# EAGLE schematic design1 (EAGLE 7.3.0)

## Sheet 1 of 3: MCU
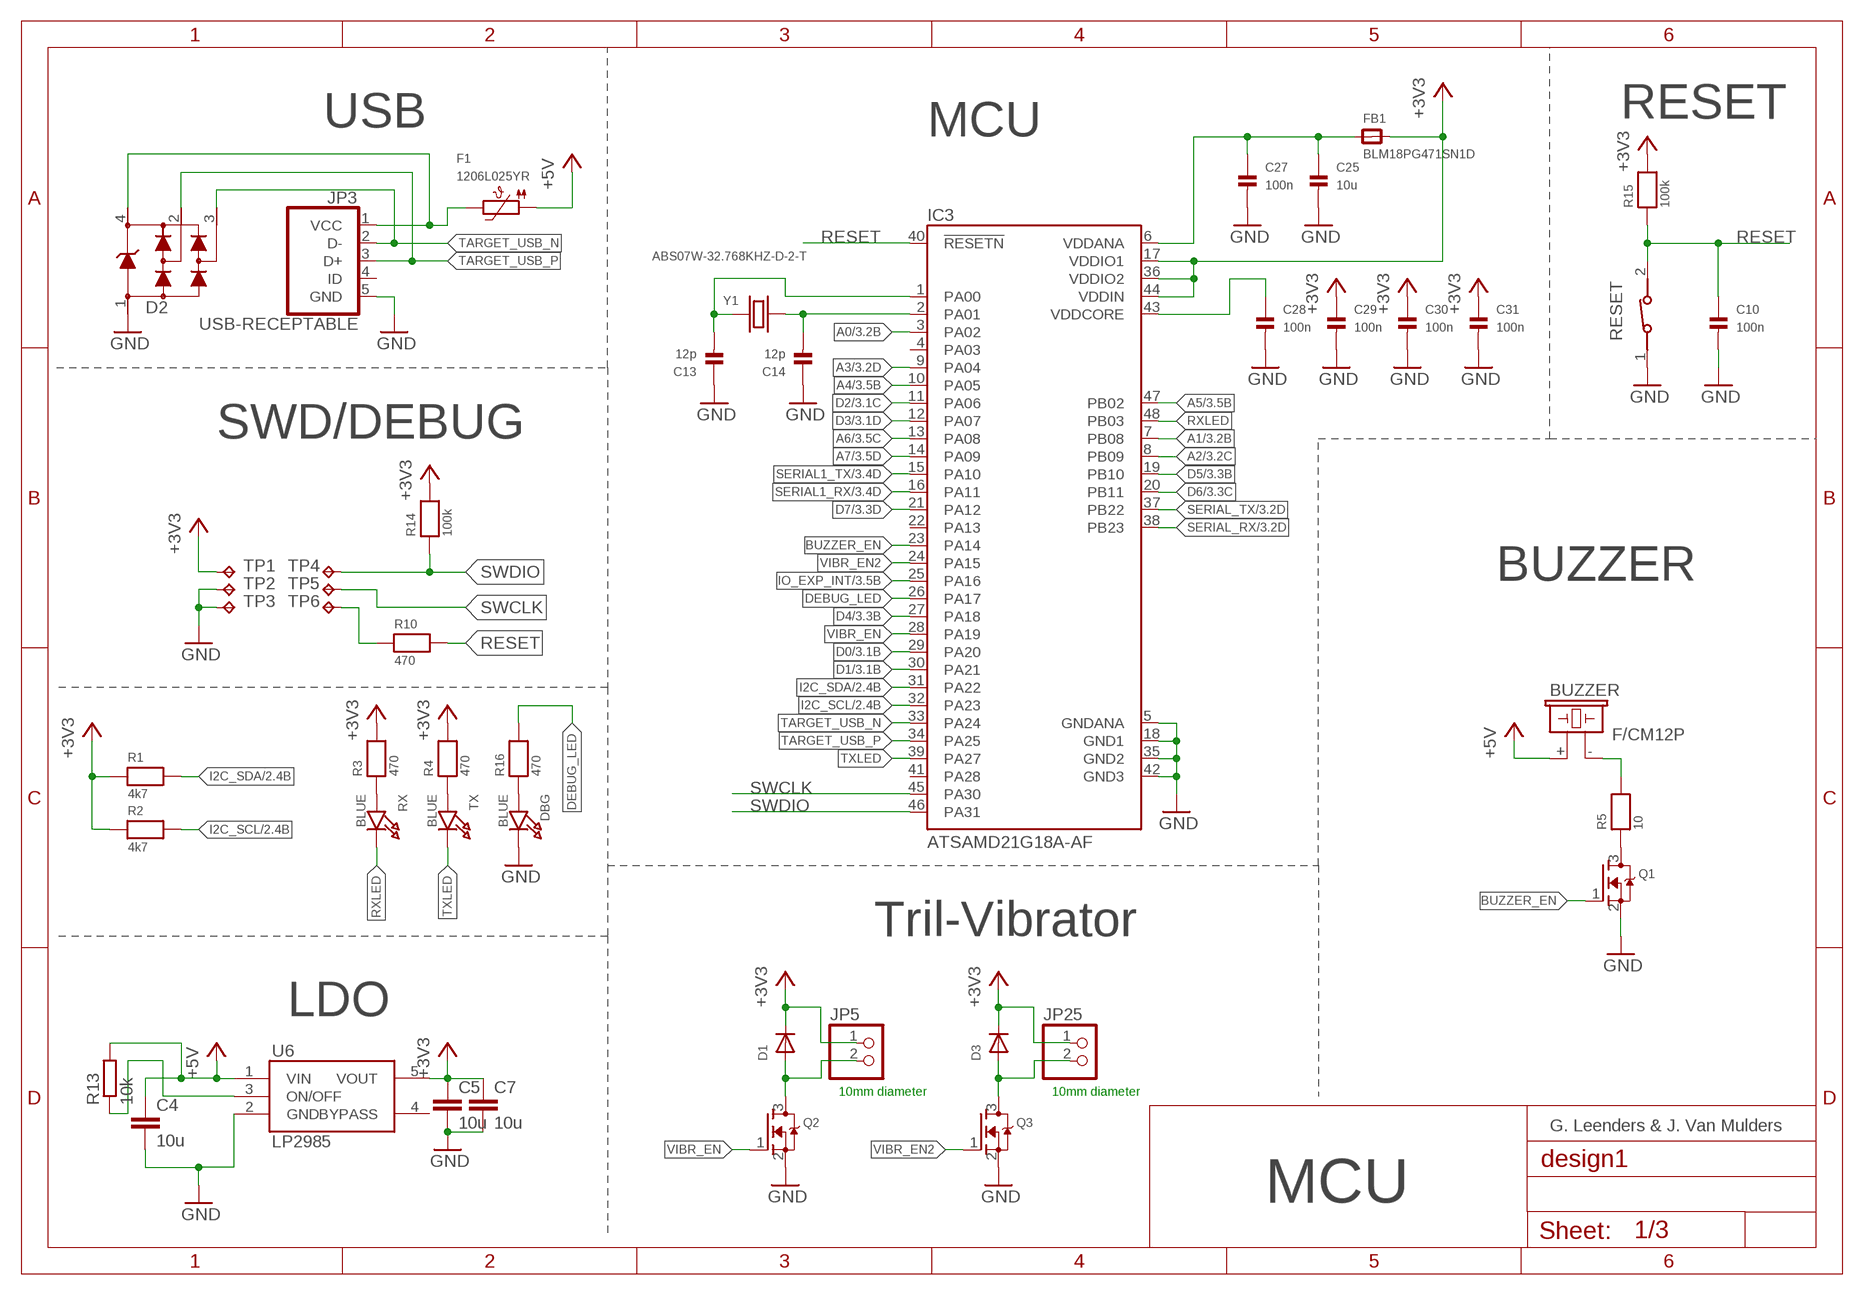
[diagram p0: schematic, sheet 1]

### Parts
BUZZER  F/CM12P  [F/CM12P]
C4  10u  C-EUC0805  [C0805]
C5  10u  C-EUC0805  [C0805]
C7  10u  C-EUC0805  [C0805]
C10  100n  CAP_CERAMIC0603  [0603]
C13  12p  CAP_CERAMIC0603  [0603]
C14  12p  CAP_CERAMIC0603  [0603]
C25  10u  CAP_CERAMIC0805  [0805]
C27  100n  CAP_CERAMIC0603  [0603]
C28  100n  CAP_CERAMIC0603  [0603]
C29  100n  CAP_CERAMIC0603  [0603]
C30  100n  CAP_CERAMIC0603  [0603]
C31  100n  CAP_CERAMIC0603  [0603]
D1  DIODESOD-123  [SOD-123]
D2  PRTR5V0U2X,215  [SOT143B]
D3  DIODESOD-123  [SOD-123]
DBG  BLUE  LED0805  [CHIPLED_0805]
F1  1206L025YR  PTC1206  [1206]
FB1  BLM18PG471SN1D  FERRITE_0603  [_0603]
IC3  ATSAMD21G18A-AF  [QFP50P900X900X120-48N]
JP3  USB-RECEPTABLE  [FCI-10103594-0001LF]
JP5  HEADER-1X2ROUND  [1X02_ROUND]
JP25  HEADER-1X2ROUND  [1X02_ROUND]
Q1  MOSFET-NWIDE  [SOT23-WIDE]
Q2  MOSFET-NWIDE  [SOT23-WIDE]
Q3  MOSFET-NWIDE  [SOT23-WIDE]
R1  4k7  RESISTOR0603  [0603]
R2  4k7  RESISTOR0603  [0603]
R3  470  RESISTOR0603  [0603]
R4  470  RESISTOR0603  [0603]
R5  10  RESISTOR0603  [0603]
R10  470  RESISTOR0603  [0603]
R13  10k  R-EU_R0603  [R0603]
R14  100k  RESISTOR0603  [0603]
R15  100k  RESISTOR0603  [0603]
R16  470  RESISTOR0603  [0603]
RESET  434111043826  [434111043826]
RX  BLUE  LED0805  [CHIPLED_0805]
TP1  TPTP11R  [TP11R]
TP2  TPTP11R  [TP11R]
TP3  TPTP11R  [TP11R]
TP4  TPTP11R  [TP11R]
TP5  TPTP11R  [TP11R]
TP6  TPTP11R  [TP11R]
TX  BLUE  LED0805  [CHIPLED_0805]
U6  LP2985AIM5-3.3  [SOT25]
Y1  ABS07W-32.768KHZ-D-2-T  [XTAL320X150X90]

### Nets
+3V3: C5.1 C7.1 C29.1 C30.1 C31.1 D1.C D3.C FB1.2 IC3.17(VDDIO1) IC3.36(VDDIO2) IC3.44(VDDIN) JP5.1 JP25.1 R1.1 R2.1 R3.2 R4.2 R14.2 R15.2 TP1.TP U6.5(VOUT) ; also sheet 2,3
+5V: BUZZER.+ C4.1 F1.1 R13.2 U6.1(VIN)
A0: IC3.3(PA02) ; also sheet 3
A1: IC3.7(PB08) ; also sheet 3
A2: IC3.8(PB09) ; also sheet 3
A3: IC3.9(PA04) ; also sheet 3
A4: IC3.10(PA05) ; also sheet 3
A5: IC3.47(PB02) ; also sheet 3
A6: IC3.13(PA08) ; also sheet 3
A7: IC3.14(PA09) ; also sheet 3
BUZZER_EN: IC3.23(PA14) Q1.1(G)
D0: IC3.29(PA20) ; also sheet 3
D1: IC3.30(PA21) ; also sheet 3
D2: IC3.11(PA06) ; also sheet 3
D3: IC3.12(PA07) ; also sheet 3
D4: IC3.27(PA18) ; also sheet 3
D5: IC3.19(PB10) ; also sheet 3
D6: IC3.20(PB11) ; also sheet 3
D7: IC3.21(PA12) ; also sheet 3
DEBUG_LED: IC3.26(PA17) R16.2
GND: C4.2 C5.2 C7.2 C10.2 C13.1 C14.1 C25.2 C27.2 C28.2 C29.2 C30.2 C31.2 D2.1 DBG.C IC3.5(GNDANA) IC3.18(GND1) IC3.35(GND2) IC3.42(GND3) JP3.5(GND) Q1.2(S) Q2.2(S) Q3.2(S) RESET.1 TP2.TP TP3.TP U6.2(GND) ; also sheet 2,3
I2C_SCL: IC3.32(PA23) R2.2 ; also sheet 2,3
I2C_SDA: IC3.31(PA22) R1.2 ; also sheet 2,3
IO_EXP_INT: IC3.25(PA16) ; also sheet 3
LDO_EN: R13.1 U6.3(ON/OFF)
N$1: R3.1 RX.A
N$2: R4.1 TX.A
N$3: BUZZER.- R5.2
N$4: C28.1 IC3.43(VDDCORE)
N$5: Q1.3(D) R5.1
N$6: C25.1 C27.1 FB1.1 IC3.6(VDDANA)
N$7: D2.4 F1.2 JP3.1(VCC)
N$8: D3.A JP25.2 Q3.3(D)
N$9: C13.2 IC3.1(PA00) Y1.1
N$10: C14.2 IC3.2(PA01) Y1.2
N$13: DBG.A R16.1
N$16: R10.1 TP6.TP
N$18: D1.A JP5.2 Q2.3(D)
RESET: C10.1 IC3.40(!RESETN) R10.2 R15.1 RESET.2
RXLED: IC3.48(PB03) RX.C
SERIAL1_RX: IC3.16(PA11) ; also sheet 3
SERIAL1_TX: IC3.15(PA10) ; also sheet 3
SERIAL_RX: IC3.38(PB23) ; also sheet 3
SERIAL_TX: IC3.37(PB22) ; also sheet 3
SWCLK: IC3.45(PA30) TP5.TP
SWDIO: IC3.46(PA31) R14.1 TP4.TP
TARGET_USB_N: D2.3 IC3.33(PA24) JP3.2(D-)
TARGET_USB_P: D2.2 IC3.34(PA25) JP3.3(D+)
TXLED: IC3.39(PA27) TX.C
VIBR_EN: IC3.28(PA19) Q2.1(G)
VIBR_EN2: IC3.24(PA15) Q3.1(G)
Unconnected: IC3.4(PA03) IC3.22(PA13) IC3.41(PA28) JP3.4(ID) U6.4(BYPASS)

### Notes on the sheet
- USB | RESET
- MCU
- SWD/DEBUG
- BUZZER
- Tril-Vibrator
- LDO
- 10mm diameter | 10mm diameter
- G. Leenders & J. Van Mulders
- MCU

## Sheet 2 of 3: 7-segment
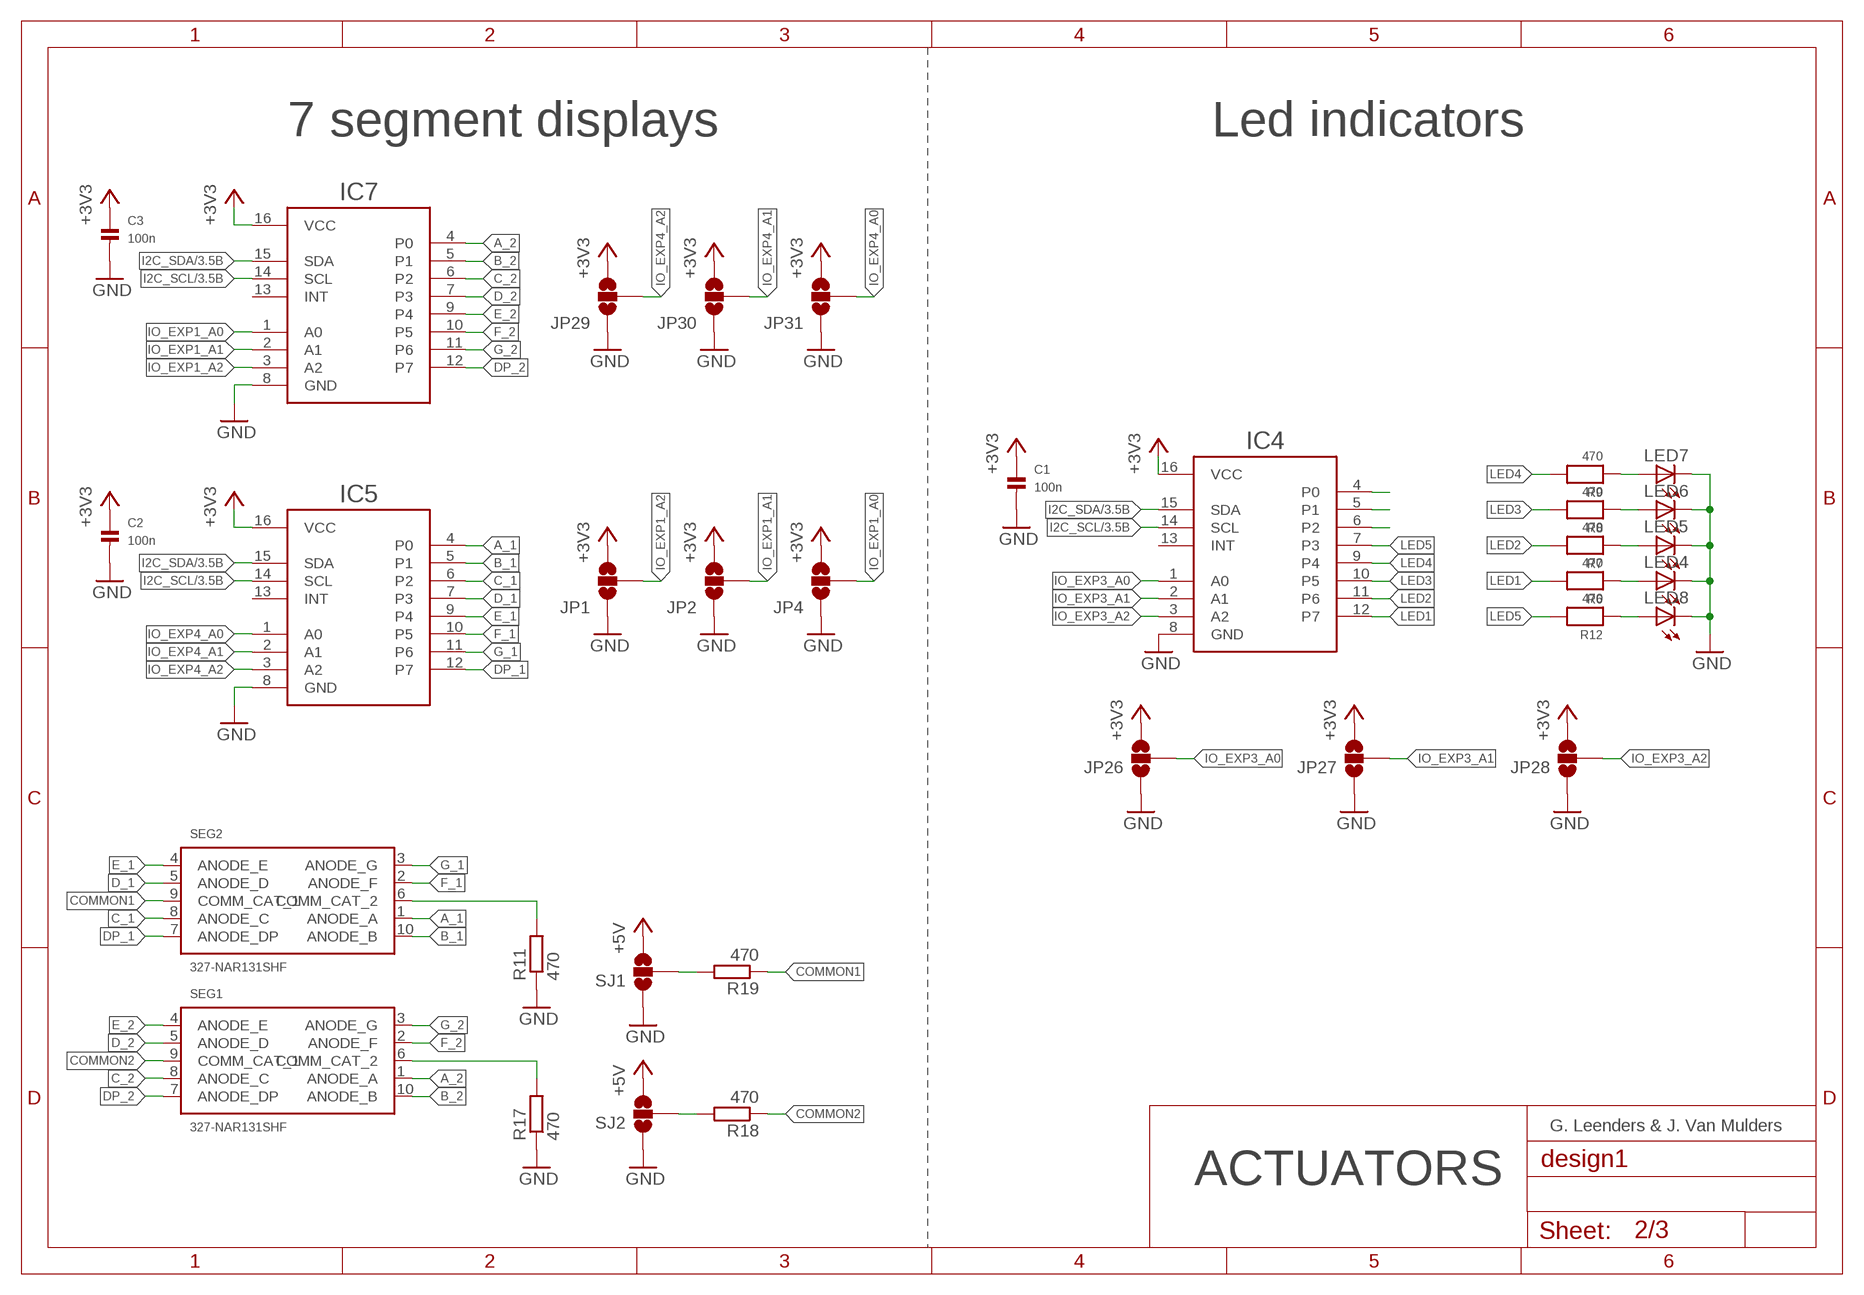
[diagram p1: schematic, sheet 2]

### Parts
C1  100n  CAP_CERAMIC0603  [0603]
C2  100n  CAP_CERAMIC0603  [0603]
C3  100n  CAP_CERAMIC0603  [0603]
IC4  TCA9554ADBR  [SSOP-16]
IC5  TCA9554ADBR  [SSOP-16]
IC7  TCA9554ADBR  [SSOP-16]
JP1  JUMPER-SMT_3_NO_NO-SILK  [SMT-JUMPER_3_NO_NO-SILK]
JP2  JUMPER-SMT_3_NO_NO-SILK  [SMT-JUMPER_3_NO_NO-SILK]
JP4  JUMPER-SMT_3_NO_NO-SILK  [SMT-JUMPER_3_NO_NO-SILK]
JP26  JUMPER-SMT_3_NO_NO-SILK  [SMT-JUMPER_3_NO_NO-SILK]
JP27  JUMPER-SMT_3_NO_NO-SILK  [SMT-JUMPER_3_NO_NO-SILK]
JP28  JUMPER-SMT_3_NO_NO-SILK  [SMT-JUMPER_3_NO_NO-SILK]
JP29  JUMPER-SMT_3_NO_NO-SILK  [SMT-JUMPER_3_NO_NO-SILK]
JP30  JUMPER-SMT_3_NO_NO-SILK  [SMT-JUMPER_3_NO_NO-SILK]
JP31  JUMPER-SMT_3_NO_NO-SILK  [SMT-JUMPER_3_NO_NO-SILK]
LED4  LED3MM  [LED3MM]
LED5  LED3MM  [LED3MM]
LED6  LED3MM  [LED3MM]
LED7  LED3MM  [LED3MM]
LED8  LED3MM  [LED3MM]
R6  470  RESISTOR0603  [0603]
R7  470  RESISTOR0603  [0603]
R8  470  RESISTOR0603  [0603]
R9  470  RESISTOR0603  [0603]
R11  470  R-EU_R0603  [R0603]
R12  470  RESISTOR0603  [0603]
R17  470  R-EU_R0603  [R0603]
R18  470  R-EU_R0603  [R0603]
R19  470  R-EU_R0603  [R0603]
SEG1  327-NAR131SHF  NAR131SH-F  [NAR131SH-F]
SEG2  327-NAR131SHF  NAR131SH-F  [NAR131SH-F]
SJ1  JUMPER-SMT_3_NO_NO-SILK  [SMT-JUMPER_3_NO_NO-SILK]
SJ2  JUMPER-SMT_3_NO_NO-SILK  [SMT-JUMPER_3_NO_NO-SILK]

### Nets
+3V3: C1.1 C2.1 C3.1 IC4.16(VCC) IC5.16(VCC) IC7.16(VCC) JP1.3 JP2.3 JP4.3 JP26.3 JP27.3 JP28.3 JP29.3 JP30.3 JP31.3 SJ1.3 SJ2.3 ; supply symbol labelled +5V ; also sheet 1,3
A_1: IC5.4(P0) SEG2.1(ANODE_A)
A_2: IC7.4(P0) SEG1.1(ANODE_A)
B_1: IC5.5(P1) SEG2.10(ANODE_B)
B_2: IC7.5(P1) SEG1.10(ANODE_B)
C_1: IC5.6(P2) SEG2.8(ANODE_C)
C_2: IC7.6(P2) SEG1.8(ANODE_C)
COMMON1: R19.1 SEG2.9(COMM_CAT_1)
COMMON2: R18.1 SEG1.9(COMM_CAT_1)
D_1: IC5.7(P3) SEG2.5(ANODE_D)
D_2: IC7.7(P3) SEG1.5(ANODE_D)
DP_1: IC5.12(P7) SEG2.7(ANODE_DP)
DP_2: IC7.12(P7) SEG1.7(ANODE_DP)
E_1: IC5.9(P4) SEG2.4(ANODE_E)
E_2: IC7.9(P4) SEG1.4(ANODE_E)
F_1: IC5.10(P5) SEG2.2(ANODE_F)
F_2: IC7.10(P5) SEG1.2(ANODE_F)
G_1: IC5.11(P6) SEG2.3(ANODE_G)
G_2: IC7.11(P6) SEG1.3(ANODE_G)
GND: C1.2 C2.2 C3.2 IC4.8(GND) IC5.8(GND) IC7.8(GND) JP1.1 JP2.1 JP4.1 JP26.1 JP27.1 JP28.1 JP29.1 JP30.1 JP31.1 LED4.K(C) LED5.K(C) LED6.K(C) LED7.K(C) LED8.K(C) R11.1 R17.1 SJ1.1 SJ2.1 ; also sheet 1,3
I2C_SCL: IC4.14(SCL) IC5.14(SCL) IC7.14(SCL) ; also sheet 1,3
I2C_SDA: IC4.15(SDA) IC5.15(SDA) IC7.15(SDA) ; also sheet 1,3
IO_EXP1_A0: IC7.1(A0) JP4.2
IO_EXP1_A1: IC7.2(A1) JP2.2
IO_EXP1_A2: IC7.3(A2) JP1.2
IO_EXP3_A0: IC4.1(A0) JP26.2
IO_EXP3_A1: IC4.2(A1) JP27.2
IO_EXP3_A2: IC4.3(A2) JP28.2
IO_EXP4_A0: IC5.1(A0) JP31.2
IO_EXP4_A1: IC5.2(A1) JP30.2
IO_EXP4_A2: IC5.3(A2) JP29.2
LED1: IC4.12(P7) R6.2
LED2: IC4.11(P6) R7.2
LED3: IC4.10(P5) R8.2
LED4: IC4.9(P4) R9.2
LED5: IC4.7(P3) R12.2
N$11: IC4.4(P0)
N$12: IC4.5(P1)
N$14: IC4.6(P2)
N$17: R17.2 SEG1.6(COMM_CAT_2)
N$19: LED8.A R12.1
N$20: LED4.A R6.1
N$21: LED5.A R7.1
N$22: LED6.A R8.1
N$23: LED7.A R9.1
N$24: R11.2 SEG2.6(COMM_CAT_2)
N$25: R19.2 SJ1.2
N$26: R18.2 SJ2.2
Unconnected: IC4.13(INT) IC5.13(INT) IC7.13(INT)

### Notes on the sheet
- 7 segment displays | Led indicators
- G. Leenders & J. Van Mulders
- ACTUATORS

## Sheet 3 of 3
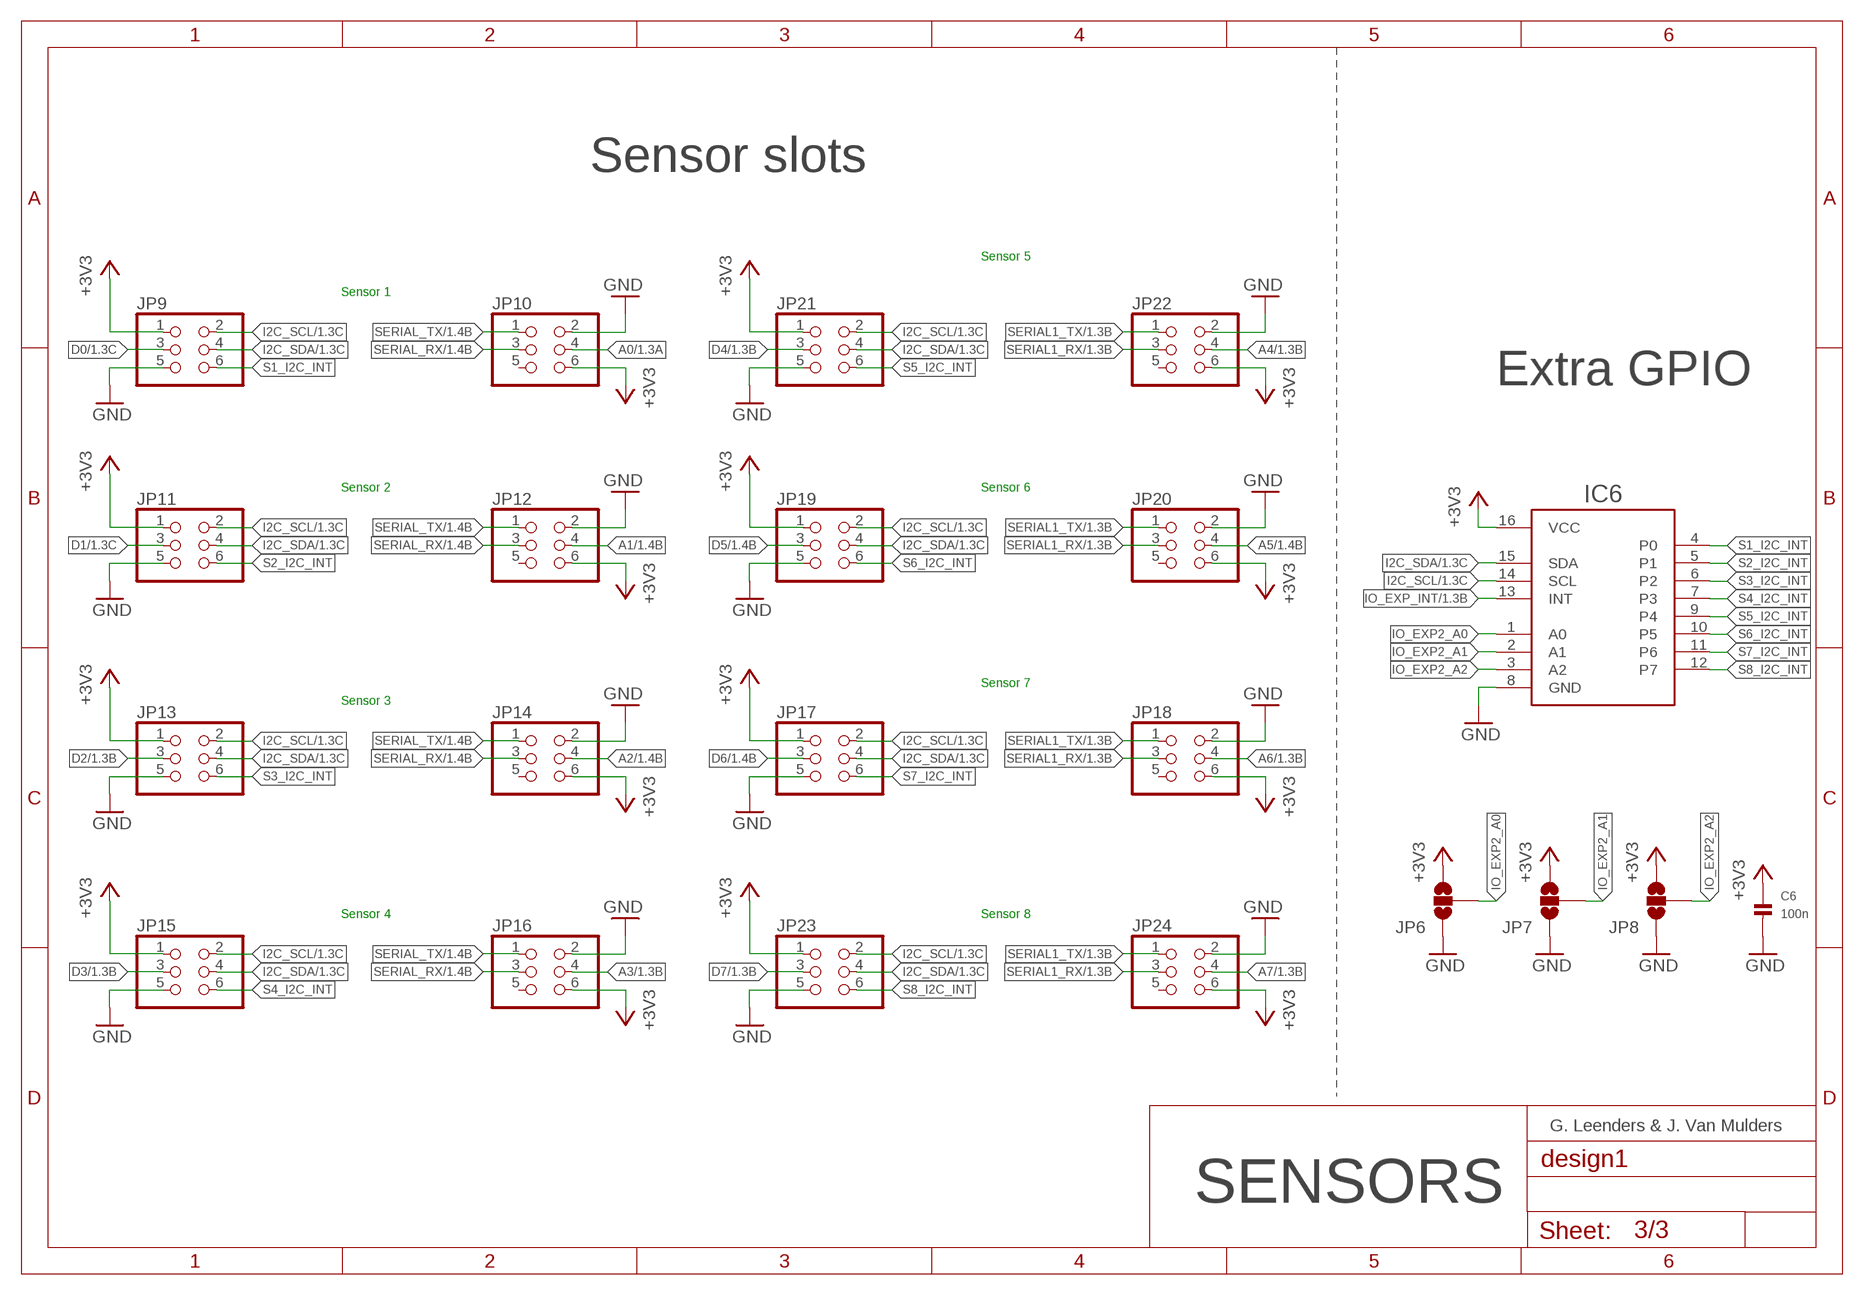
[diagram p2: schematic, sheet 3]

### Parts
C6  100n  CAP_CERAMIC0603  [0603]
IC6  TCA9554ADBR  [SSOP-16]
JP6  JUMPER-SMT_3_NO_NO-SILK  [SMT-JUMPER_3_NO_NO-SILK]
JP7  JUMPER-SMT_3_NO_NO-SILK  [SMT-JUMPER_3_NO_NO-SILK]
JP8  JUMPER-SMT_3_NO_NO-SILK  [SMT-JUMPER_3_NO_NO-SILK]
JP9  HEADER-2X3  [2X03_ROUND_70MIL]
JP10  HEADER-2X3  [2X03_ROUND_70MIL]
JP11  HEADER-2X3  [2X03_ROUND_70MIL]
JP12  HEADER-2X3  [2X03_ROUND_70MIL]
JP13  HEADER-2X3  [2X03_ROUND_70MIL]
JP14  HEADER-2X3  [2X03_ROUND_70MIL]
JP15  HEADER-2X3  [2X03_ROUND_70MIL]
JP16  HEADER-2X3  [2X03_ROUND_70MIL]
JP17  HEADER-2X3  [2X03_ROUND_70MIL]
JP18  HEADER-2X3  [2X03_ROUND_70MIL]
JP19  HEADER-2X3  [2X03_ROUND_70MIL]
JP20  HEADER-2X3  [2X03_ROUND_70MIL]
JP21  HEADER-2X3  [2X03_ROUND_70MIL]
JP22  HEADER-2X3  [2X03_ROUND_70MIL]
JP23  HEADER-2X3  [2X03_ROUND_70MIL]
JP24  HEADER-2X3  [2X03_ROUND_70MIL]

### Nets
+3V3: C6.1 IC6.16(VCC) JP6.3 JP7.3 JP8.3 JP9.1 JP10.6 JP11.1 JP12.6 JP13.1 JP14.6 JP15.1 JP16.6 JP17.1 JP18.6 JP19.1 JP20.6 JP21.1 JP22.6 JP23.1 JP24.6 ; also sheet 1,2
A0: JP10.4 ; also sheet 1
A1: JP12.4 ; also sheet 1
A2: JP14.4 ; also sheet 1
A3: JP16.4 ; also sheet 1
A4: JP22.4 ; also sheet 1
A5: JP20.4 ; also sheet 1
A6: JP18.4 ; also sheet 1
A7: JP24.4 ; also sheet 1
D0: JP9.3 ; also sheet 1
D1: JP11.3 ; also sheet 1
D2: JP13.3 ; also sheet 1
D3: JP15.3 ; also sheet 1
D4: JP21.3 ; also sheet 1
D5: JP19.3 ; also sheet 1
D6: JP17.3 ; also sheet 1
D7: JP23.3 ; also sheet 1
GND: C6.2 IC6.8(GND) JP6.1 JP7.1 JP8.1 JP9.5 JP10.2 JP11.5 JP12.2 JP13.5 JP14.2 JP15.5 JP16.2 JP17.5 JP18.2 JP19.5 JP20.2 JP21.5 JP22.2 JP23.5 JP24.2 ; also sheet 1,2
I2C_SCL: IC6.14(SCL) JP9.2 JP11.2 JP13.2 JP15.2 JP17.2 JP19.2 JP21.2 JP23.2 ; also sheet 1,2
I2C_SDA: IC6.15(SDA) JP9.4 JP11.4 JP13.4 JP15.4 JP17.4 JP19.4 JP21.4 JP23.4 ; also sheet 1,2
IO_EXP2_A0: IC6.1(A0) JP6.2
IO_EXP2_A1: IC6.2(A1) JP7.2
IO_EXP2_A2: IC6.3(A2) JP8.2
IO_EXP_INT: IC6.13(INT) ; also sheet 1
S1_I2C_INT: IC6.4(P0) JP9.6
S2_I2C_INT: IC6.5(P1) JP11.6
S3_I2C_INT: IC6.6(P2) JP13.6
S4_I2C_INT: IC6.7(P3) JP15.6
S5_I2C_INT: IC6.9(P4) JP21.6
S6_I2C_INT: IC6.10(P5) JP19.6
S7_I2C_INT: IC6.11(P6) JP17.6
S8_I2C_INT: IC6.12(P7) JP23.6
SERIAL1_RX: JP18.3 JP20.3 JP22.3 JP24.3 ; also sheet 1
SERIAL1_TX: JP18.1 JP20.1 JP22.1 JP24.1 ; also sheet 1
SERIAL_RX: JP10.3 JP12.3 JP14.3 JP16.3 ; also sheet 1
SERIAL_TX: JP10.1 JP12.1 JP14.1 JP16.1 ; also sheet 1
Unconnected: JP10.5 JP12.5 JP14.5 JP16.5 JP18.5 JP20.5 JP22.5 JP24.5

### Notes on the sheet
- Sensor slots
- Sensor 5
- Sensor 1
- Extra GPIO
- Sensor 2 | Sensor 6
- Sensor 7
- Sensor 3
- Sensor 4 | Sensor 8
- G. Leenders & J. Van Mulders
- SENSORS

## Library data of the parts
BUZZER = buzzer:F/CM12P: BUZZER Source: Buerklin; OC_FARNELL: unknown; OC_NEWARK: unknown
C1-C3 C6 C10 C13 C14 C25 C27-C31 = microbuilder:CAP_CERAMIC: Ceramic Capacitors 0402 - 0402 Surface Mount Capacitors 16pF 50V 5% [Digikey: 445-4899-2-ND] 18pF 50V 5% [Digikey: 490-1281-2-ND] 22pF 50V 5% [Digikey: 490-1283-2-ND] 68pF 50V 5% [Digikey: 490-1289-2-ND] 0.1uF 10V 10% [Digikey: 490-1318-2-ND] 1.0uF 6.3V 10% [Digikey: 490-1320-2-ND] 0603 - 0603 Surface Mount Capacitors 16 pF 50V 5% [Digikey: 445-5051-2-ND] 22 pF 50V [Digikey: PCC220ACVTR-ND] 33 pF 50V 5% [Digikey: 490-1415-1-ND] 56pF 50V 5% [Digikey: 490-1421-1-ND] 220pF 50V 5% [Digikey: 445-1285-1-ND] 680 pF 50V 2200 pF 50V 5% C0G [Digikey: 445-1297-1-ND] 5600 pF 100V 5% X7R [Digikey: 478-3711-1-ND] 0.1 µF 25V 10% [Digikey: PCC2277TR-ND] 0.22 µF 16V 10% X7R [Digikey: 445-1318-1-ND] 1.0 µF 25V 10% [Digikey: 445-5146-2-ND] 0603 - RF Specific 3pF 250V +/-0.1pF RF [Digikey: 712-1347-1-ND] 18 pF 250V 5% [Digikey: 478-3505-1-ND or 712-1322-1-ND] 56 pF 250V 5% C0G RF [Digikey: 490-4867-1-ND] 68 pF 250V RF [Digikey: 490-4868-1-ND] 0805 - 0805 Surface Mount Capacitors 220 pF 250V 2% RF Ceramic Capacitor [Digikey: 712-1398-1-ND] 1000 pF 50V 2% NP0 Ceramic Capacitor [Digikey: 478-3760-1-ND] 0.1 µF 25V 10% Ceramic Capacitor [Digikey: PCC1828TR-ND] 1.0 µF 16V 10% Ceramic Capacitor[Digikey: 490-1691-2-ND] 10.0 µF 10V 10% Ceramic Capacitor[Digikey: 709-1228-1-ND] 10.0 uF 16V 10% Ceramic Capacitor [Digikey: 478-5165-2-ND] 47 uF 6.3V 20% Ceramic Capacitor [Digikey: 587-1779-1-ND or 399-5506-1-ND] 1206 - 1206 Surface Mount Capacitors 47uF 10V 20% Ceramic Capacitor [Digikey: 490-5528-1-ND or 399-5508-1-ND or 445-6010-1-ND] 100uF 6.3V -20%, +80% Y5V Ceramic Capacitor (Digikey: 490-4512-1-ND, Mouser: 81-GRM31CF50J107ZE1L)
C4 C5 C7 = rcl:C-EU: CAPACITOR, European symbol
D1 D3 = microbuilder:DIODE: Diode SMA Model Volts Amps Type Vf Vr Digikey # Notes SSA34-E3 40V 3A Schottky 480mV @ 3A 200uA @ 40V SSA34-E3/61TGITR-ND CDBA120-G 20V 1A Schottky 500mV @ 1A 500uA @ 20V 641-1014-6-ND REEL MBRA210 10V 2A Schottky 350mV @ 2A 700uA @ 10V MBRA210LT3 SOD-123 Model Volts Amps Type Vf Vr Order # Notes BAT54T1G 30V 200mA Schottky 800mV @ 200mA 2uA @ 25V BAT54T1GOSTR-ND B0530W 30V 500mA Schottky 430mV @ 500mA 130uA @ 30V B0530W-FDICT-ND REEL MBR120 1A 20V Schottky 340mV @ 1A MBR120VLSFT1GOSCT-ND SOD-323 Model Volts Amps Type Vf Vr Order # Notes PMEG2005EJ 20V 500mA Schottky 355mV @ 500mA 568-4110-1-ND ZLLS410 10V 570mA Schottky 380mV @ 570mA ZLLS410CT-ND 1N4148WS 75V 150mA Silicon/Simple 1V 1N4148WSFSCT-ND REEL SOD-523 Model Volts Amps Type Vf Vr Order # Notes BAT54XV2 30V 200mA Schottky 0.8V @ 100mA BAT54XV2CT-ND TB751S 30V 30mA Schottky RB751S-40TE61CT-ND SOT23-R/W (R = Solder Paste/Reflow Ovens, W = Hand-Soldering) Model Volts Amps Type Vf Vr Order # Notes BAT54FILM 40V 300mA Schottky 497-7162-1-ND
D2 = PRTR5V0U2X_215:PRTR5V0U2X,215: Ultra low capacitance double rail-to-rail ESD protection diode Check prices <https://pricing.snapeda.com/parts/PRTR5V0U2X%2C215/Nexperia%20USA%20Inc./view-part?ref=eda>; AVAILABILITY: Good; DESCRIPTION: Clamp Ipp Tvs Diode Surface Mount SOT-143B; MF: Nexperia USA Inc.; MP: PRTR5V0U2X,215; PACKAGE: TO-253-4 Nexperia USA Inc.; PRICE: None; PURCHASE-URL: https://pricing.snapeda.com/search/part/PRTR5V0U2X,215/?ref=eda
DBG RX TX = microbuilder:LED: LED
F1 = microbuilder:PTC: PTC (Resettable Fuse) 1206 Package 250mA PTC (16V Max, Time-to-Trip: 0.08s) - Digikey: F2110CT-ND 1210 Package 100mA PTC (30V Max, Time-to-Trip: 0.6s) - Digikey: MF-USMF010-2CT-ND 1812 Package 750mA PTC (24V Max, Time-to-Trip: 0.2s) - Digikey: MF-MSMF075/24-2CT-ND
FB1 = microbuilder:FERRITE: Ferrite Bead 0603 MMZ1608B121C - 120 Ohm @ 100MHz, 600mA, 0.15 Ohm DC Resistance - Digikey: 445-2164-1-ND BK1608HW121-T - 120 Ohm, 600mA Ferrite Chip - Digikey: 587-1876-2-ND 0805 HZ0805B272R-10 - 2.7K Ohm @ 100MHz, 200mA, 0.8 Ohm DC Resistance - Digikey: 240-2504-1-ND (see also Murata BLM21BD272SN1L) MMZ2012Y152B - 1.5K Ohm @ 100MHz, 500mA, 0.4 Ohm DC Resistance - Digikey: 445-1560-1-ND - Mainly for high frequency (80-400MHz) MMZ2012R102A - 1K Ohm @ 100MHz, 500mA, 0.3 Ohm DC Resistance - Digikey: 445-1555-2-ND - More general purpose (10-200MHz)
IC3 = ATSAMD21G18A-AF:ATSAMD21G18A-AF: Cortex-M0+, 256KB FLASH, 32KB SRAM, USB, DMA, T&R - 48TQFP IND TEMP, GREEN, 1.6-3.6V, 48MHz Check prices <https://pricing.snapeda.com/parts/ATSAMD21G18A-AF/Microchip%20Technology/view-part?ref=eda>; AVAILABILITY: Good; DESCRIPTION: ARM® Cortex®-M0+ Automotive, AEC-Q100, SAM D21G, Functional Safety (FuSa) Microcontroller IC 32-Bit 48MHz 256KB (256K x 8) FLASH 48-TQFP (7x7); MF: Microchip Technology; MP: ATSAMD21G18A-AF; PACKAGE: TQFP-48 Microchip; PRICE: None; PURCHASE-URL: https://pricing.snapeda.com/search/part/ATSAMD21G18A-AF/?ref=eda
IC4-IC7 = TCA9554ADBQR:TCA9554ADBR
JP1 JP2 JP4 JP6-JP8 JP26-JP31 SJ1 SJ2 = SparkFun-Jumpers:JUMPER-SMT_3_NO: Normally open jumper This jumper has three pads in close proximity to each other. Apply solder to close the connection(s).
JP3 = daspilker:USB-RECEPTABLE: USB Receptable
JP5 JP25 = microbuilder:HEADER-1X2: PIN HEADER
JP9-JP24 = microbuilder:HEADER-2X3: PIN HEADER
LED4-LED8 = led:LED: LED
Q1-Q3 = microbuilder:MOSFET-N: N-Channel Mosfet LEGEND VDS: Voltage Drain-Source ID: Drain Current RDS(ON): Drain-Source On-State Resistance VGS(TH): Gate-Source Threshold Voltage CISS: Drain-Source Input Capacitance SOT-23 Name VDS ID RDS(ON) VGS(TH) CISS Order Number 2N7002E 60V 260mA 2.5 Ohm 2.5V @ 250uA 26.7pF @ 25V 2N7002ET1GOSTR-ND BSH103 30V 850mA 400 mOhm 400mV @ 1mA 83pF @ 24V BSH103,235-ND BSS138 60V 320mA 1.6 Ohm 1.5V @ 250uA 50pF @ 10V Mouser: 771-BSS138PW115 DMN2075U-7 20V 4.2A 38 mOhm 1V @ 250 uA 594.3pF @ 10V DMN2075U-7DICT-ND * BSS138 good choice for I2C level-shifting
R1-R10 R12 R14-R16 = microbuilder:RESISTOR: Resistors 0402 - 0402 Surface Mount Package 22 Ohm 1% 1/16W [Digikey: 311-22.0LRTR-ND] 33 Ohm 5% 1/16W 1.0K 5% 1/16W 1.5K 5% 1/16W 2.0K 1% 1/16W 10.0K 1% 1/16W [Digikey: 311-10.0KLRTR-ND] 10.0K 5% 1/16W [Digikey: RMCF0402JT10K0TR-ND] 12.1K 1% 1/16W [Digikey: 311-22.0LRTR-ND] 100.0K 5% 1/16W 0603 - 0603 Surface Mount Package 0 Ohm 1/10 Watt 1% Resistor 15 Ohm 1/10 Watt 1% Resistor 33 Ohm 1/10 Watt 1% Resistor 49.9 Ohm 1/10 Watt 1% Resistor 100 Ohm 1/10 Watt 1% Resistor 150 Ohm 1/10 Watt 1% Resistor 240 Ohm 1/10 Watt 1% Resistor 390 Ohm 1/10 Watt 1% Resistor 560 Ohm 1/10 Watt 1% Resistor 680 Ohm 1/10 Watt 1% Resistor 750 Ohm 1/10 Watt 1% Resistor 1.0K Ohm 1/10 Watt 1% Resistor 1.5K Ohm 1/10 Watt 1% Resistor 2.0K Ohm 1/10 Watt 1% Resistor 2.2K Ohm 1/10 Watt 1% Resistor 3.3K Ohm 1/10 Watt 1% Resistor 4.7K Ohm 1/10 Watt 1% Resistor 10.0K Ohm 1/10 Watt 1% Resistor 12.0K Ohm 1/10 Watt 1% Resistor 12.1K Ohm 1/10 Watt 1% Resistor 20.0K Ohm 1/10 Watt 1% Resistor 33.0K Ohm 1/10 Watt 1% Resistor 100.0K Ohm 1/10 Watt 1% Resistor 0805 - 0805 Surface Mount Package 0 Ohm 1/8 Watt 1% Resistor 33 Ohm 1/8 Watt 1% Resistor 100 Ohm 1/8 Watt 1% Resistor 150 Ohm 1/8 Watt 1% Resistor 200 Ohm 1/8 Watt 1% Resistor 240 Ohm 1/8 Watt 1% Resistor 330 Ohm 1/8 Watt 1% Resistor 390 Ohm 1/8 Watt 1% Resistor 470 Ohm 1/8 Watt 1% Resistor 1.0K Ohm 1/8 Watt 1% Resistor 1.5K Ohm 1/8 Watt 1% Resistor 2.0K Ohm 1/8 Watt 1% Resistor 4.7K Ohm 1/8 Watt 1% Resistor 5.1K Ohm 1/8 Watt 1% Resistor 5.6K Ohm 1/8 Watt 1% Resistor 10.0K Ohm 1/8 Watt 1% Resistor 22.0K Ohm 1/8 Watt 1% Resistor 33.0K Ohm 1/8 Watt 1% Resistor 100K Ohm 1/8 Watt 1% Resistor 1206 - 1206 Surface Mount Package 2012 - 2010 Surface Mount Package 0.11 Ohm 1/2 Watt 1% Resistor - Digikey: RHM.11UCT-ND
R11 R13 R17-R19 = rcl:R-EU_: RESISTOR, European symbol
RESET = Eagle_SWITCHES (rev18c):434111043826: 6.0x3.5 mm SMD WS-TASV <http://katalog.we-online.de/media/images/v2/Family_WS-TASV_6.0x3.jpg> Details see: http://katalog.we-online.de/em/datasheet/4341x1xxx8x6.pdf 2015 (C) Wurth Elektronik
SEG1 SEG2 = NAR131SH-F:NAR131SH-F
TP1-TP6 = testpad:TP: Test pad
U6 = LP2985:LP2985: LP2985-N Micropower 150 mA Low-Noise Ultra Low-Dropout Regulator
Y1 = ABS07W-32.768KHZ-D-2-T:ABS07W-32.768KHZ-D-2-T: ABS07 Series 32.768 kHz ±20 ppm 12.5 pF -40 to +85 C SMT Low Profile Crystal Check prices <https://pricing.snapeda.com/parts/ABS07W-32.768KHZ-D-2-T/Abracon/view-part?ref=eda>; AVAILABILITY: Warning; DESCRIPTION: 32.768kHz ±20ppm Crystal 3pF 55 kOhms 2-SMD, No Lead; MF: Abracon; MP: ABS07W-32.768KHZ-D-2-T; PACKAGE: SMD-2 Abracon; PRICE: None; PURCHASE-URL: https://pricing.snapeda.com/search/part/ABS07W-32.768KHZ-D-2-T/?ref=eda

## Net classes
0 default: clearance 0.205 mm